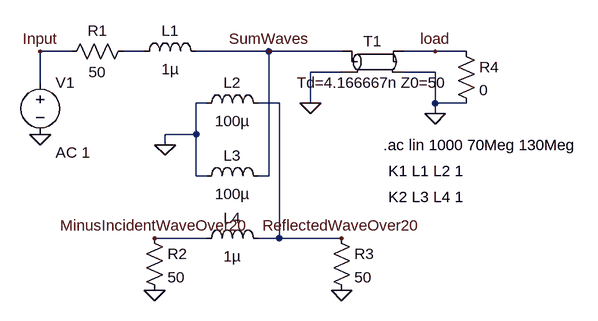
[diagram p0: schematic 2a.asc]
2a.asc, the LTspice schematic file:
Version 4.1
SHEET 1 880 680
WIRE 64 80 16 80
WIRE 176 80 144 80
WIRE 368 80 256 80
WIRE 480 80 368 80
WIRE 624 80 576 80
WIRE 672 80 624 80
WIRE 480 112 432 112
WIRE 624 112 576 112
WIRE 16 128 16 80
WIRE 272 160 256 160
WIRE 384 160 352 160
WIRE 432 160 432 112
WIRE 624 160 624 112
WIRE 672 160 624 160
WIRE 624 176 624 160
WIRE 256 208 256 160
WIRE 256 208 208 208
WIRE 208 224 208 208
WIRE 256 272 256 208
WIRE 272 272 256 272
WIRE 368 272 368 80
WIRE 368 272 352 272
WIRE 272 368 192 368
WIRE 384 368 384 160
WIRE 384 368 352 368
WIRE 480 368 384 368
FLAG 16 208 0
FLAG 192 448 0
FLAG 480 448 0
FLAG 432 160 0
FLAG 624 176 0
FLAG 368 80 SumWaves
FLAG 624 80 load
FLAG 480 368 ReflectedWaveOver20
FLAG 192 368 MinusIncidentWaveOver20
FLAG 16 80 Input
FLAG 208 224 0
SYMBOL voltage 16 112 R0
WINDOW 123 24 124 Left 2
WINDOW 39 0 0 Left 0
SYMATTR Value2 AC 1
SYMATTR InstName V1
SYMATTR Value ""
SYMBOL res 160 64 R90
WINDOW 0 0 56 VBottom 2
WINDOW 3 32 56 VTop 2
SYMATTR InstName R1
SYMATTR Value 50
SYMBOL ind 160 96 R270
WINDOW 0 32 56 VTop 2
WINDOW 3 4 56 VBottom 2
SYMATTR InstName L1
SYMATTR Value 1µ
SYMATTR SpiceLine Rser=1m
SYMATTR Type ind
SYMBOL ind 256 176 R270
WINDOW 0 32 56 VTop 2
WINDOW 3 4 56 VBottom 2
SYMATTR InstName L2
SYMATTR Value 100µ
SYMATTR SpiceLine Rser=1m
SYMATTR Type ind
SYMBOL ind 256 288 R270
WINDOW 0 32 56 VTop 2
WINDOW 3 4 56 VBottom 2
SYMATTR InstName L3
SYMATTR Value 100µ
SYMATTR SpiceLine Rser=1m
SYMATTR Type ind
SYMBOL ind 256 384 R270
WINDOW 0 32 56 VTop 2
WINDOW 3 4 56 VBottom 2
SYMATTR InstName L4
SYMATTR Value 1µ
SYMATTR SpiceLine Rser=1m
SYMATTR Type ind
SYMBOL res 176 352 R0
SYMATTR InstName R2
SYMATTR Value 50
SYMBOL res 464 352 R0
SYMATTR InstName R3
SYMATTR Value 50
SYMBOL tline 528 96 R0
SYMATTR InstName T1
SYMATTR Value Td=4.166667n Z0=50
SYMBOL res 656 64 R0
SYMATTR InstName R4
SYMATTR Value 0
TEXT 544 224 Left 2 !.ac lin 1000 70Meg 130Meg
TEXT 552 264 Left 2 !K1 L1 L2 1
TEXT 552 304 Left 2 !K2 L3 L4 1

The netlist it stands for:
* 2a.asc
V1 Input 0 AC 1
R1 N001 Input 50
L1 N001 SumWaves 1µ Rser=1m
L2 0 ReflectedWaveOver20 100µ Rser=1m
L3 0 SumWaves 100µ Rser=1m
L4 MinusIncidentWaveOver20 ReflectedWaveOver20 1µ Rser=1m
R2 MinusIncidentWaveOver20 0 50
R3 ReflectedWaveOver20 0 50
T1 SumWaves 0 load 0 Td=4.166667n Z0=50
R4 load 0 0
.ac lin 1000 70Meg 130Meg
K1 L1 L2 1
K2 L3 L4 1
.backanno
.end